# EasyEDA Pro project W5500-ESP32c3-supermini.epro

# Schematic Schematic1
Board Name: Board1; Create Date: 2026-04-03; Page Name: P1; Project Name: New Project_2026-04-03_12-46-23; Schematic Name: Schematic1; Update Date: 2026-04-04; Company: EasyEDA.com; Page Size: A4; Version: V1.0
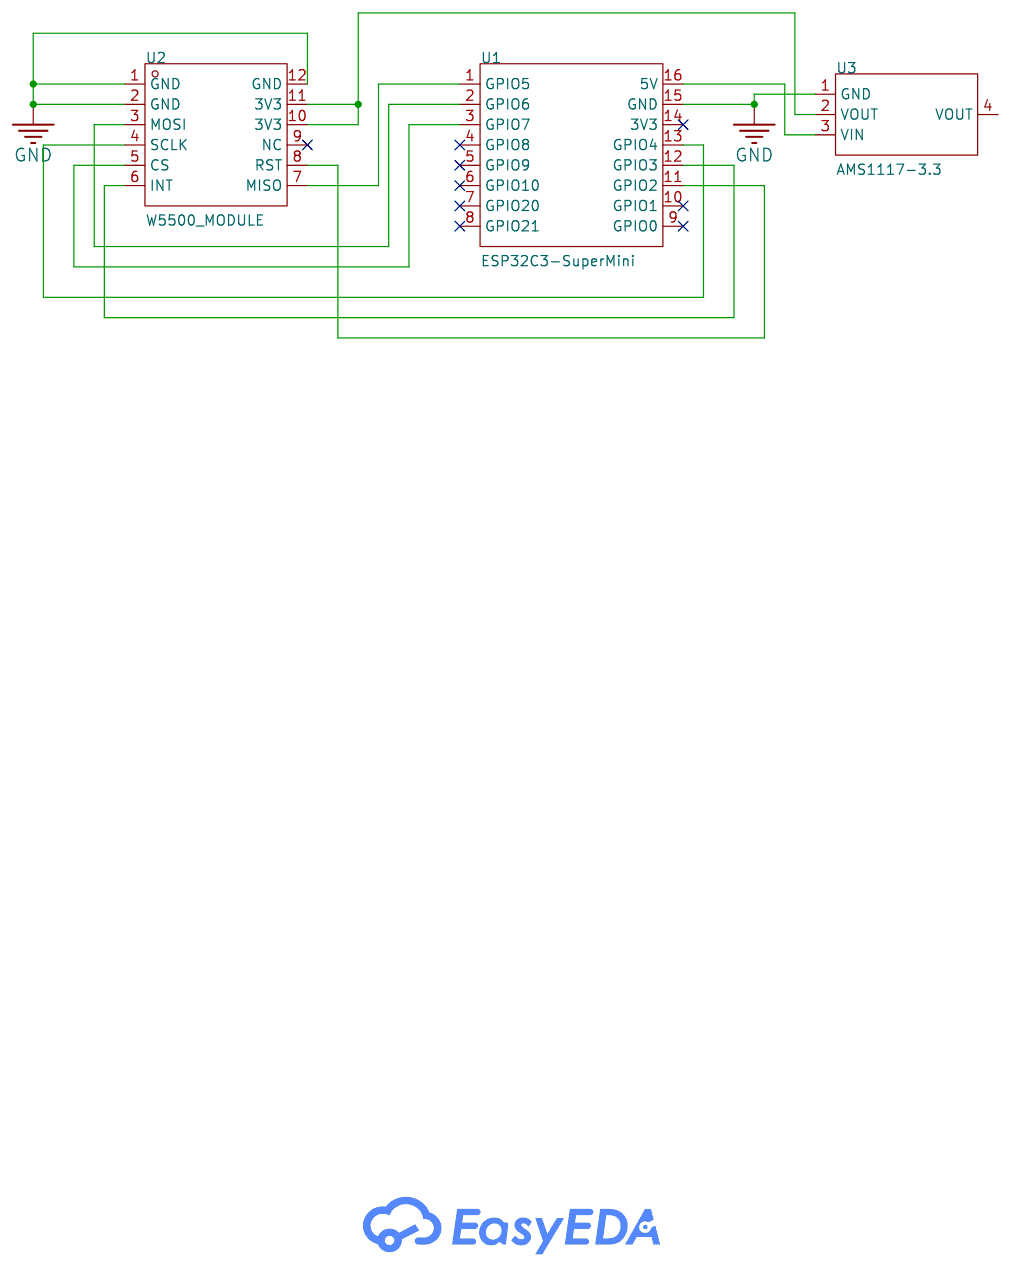
[diagram p0: schematic sheet]

## Parts
U1  ESP32C3-SuperMini  [COMM-SMD_16P-L22.5-W18.0-P2.54-TL]
U2  W5500_MODULE  [COMM-TH_L25.0-W23.0_W5500_MODULE]
U3  AMS1117-3.3  [SOT-223-3_L6.5-W3.4-P2.30-LS7.0-BR]

## Library data of the parts
U1 = ESP32C3-SuperMini: Supplier Part: C9900147397; Supplier Footprint: SMD-16P; JLCPCB Part Class: Extended Part; Supplier: LCSC
U2 = W5500_MODULE: Supplier Part: C9900160625; Supplier Footprint: 插件; Supplier: LCSC
U3 = AMS1117-3.3_C6186: Output Type:Fixed Voltage - Supply:15V Output Voltage:3.3V Output Voltage:3.3V Output Current:1A Power Supply Rejection Ratio (PSRR):72dB@(120Hz) Voltage Dropout:1.1V@(800mA) standby current:5mA Noise:0.003%Vout Features:Over Current Protection；Thermal Sh; LCSC Part Name: 3.3V 1A 15V; Supplier Part: C6186; Manufacturer: AMS; Supplier Footprint: SOT-223; JLCPCB Part Class: Basic Part; Datasheet: https://item.szlcsc.com/datasheet/AMS1117-3.3/6652.html; Supplier: LCSC; Output Type: Fixed; Voltage - Supply: 15V; Output Voltage: 3.3V; Output Current: 1A; Power Supply Rejection Ratio (PSRR): 72dB@(120Hz); Voltage Dropout: 1.1V@(800mA); standby current: 5mA; Noise: 0.003%Vout; Features: Over Current Protection；Thermal Shutdown; Operating Temperature: -40℃~+125℃; Output Configuration: Positive; Number of Outputs: 1

## Nets
GND: U1.15(GND) U2.1(GND) U2.2(GND) U2.12(GND) U3.1(GND)
$1N916: U1.16(5V) U3.3(VIN)
$1N945: U2.10(3V3) U2.11(3V3) U3.2(VOUT)
$1N963: U1.1(GPIO5) U2.7(MISO)
$1N981: U1.2(GPIO6) U2.3(MOSI)
$1N1018: U1.13(GPIO4) U2.4(SCLK)
$1N1030: U1.3(GPIO7) U2.5(CS)
$1N1039: U1.12(GPIO3) U2.6(INT)
$1N1051: U1.11(GPIO2) U2.8(RST)

Not connected (* = marked no-connect by the designer): U1 4(GPIO8)* 5(GPIO9)* 6(GPIO10)* 7(GPIO20)* 8(GPIO21)* 9(GPIO0)* 10(GPIO1)* 14(3V3)*; U2 9(NC)*; U3 4(VOUT)

# Board PCB4
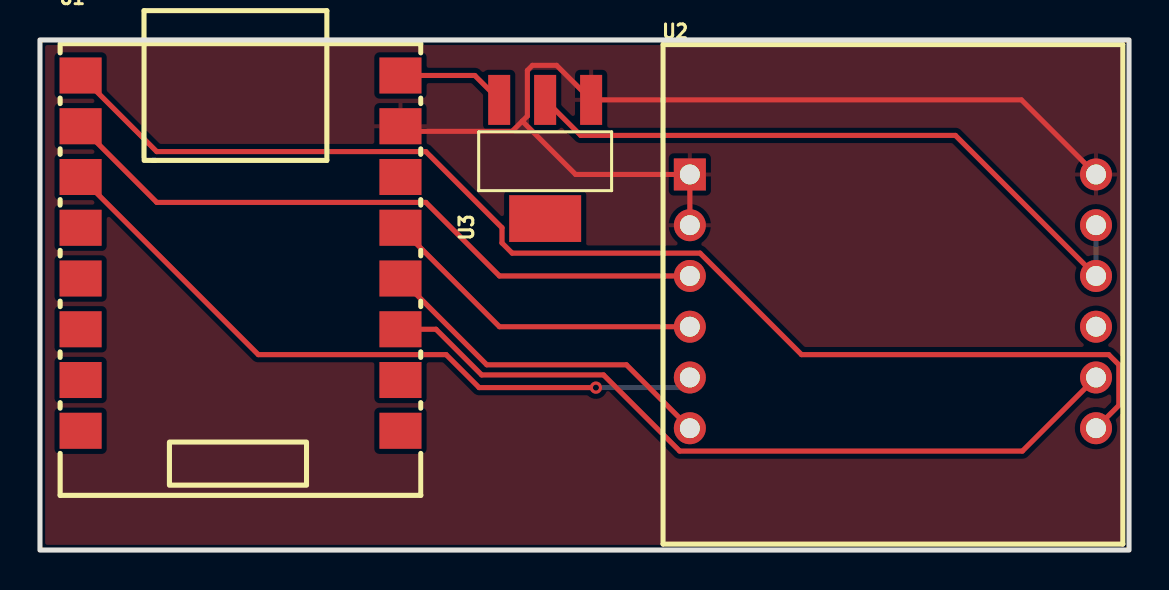
[diagram p1: board, top side]
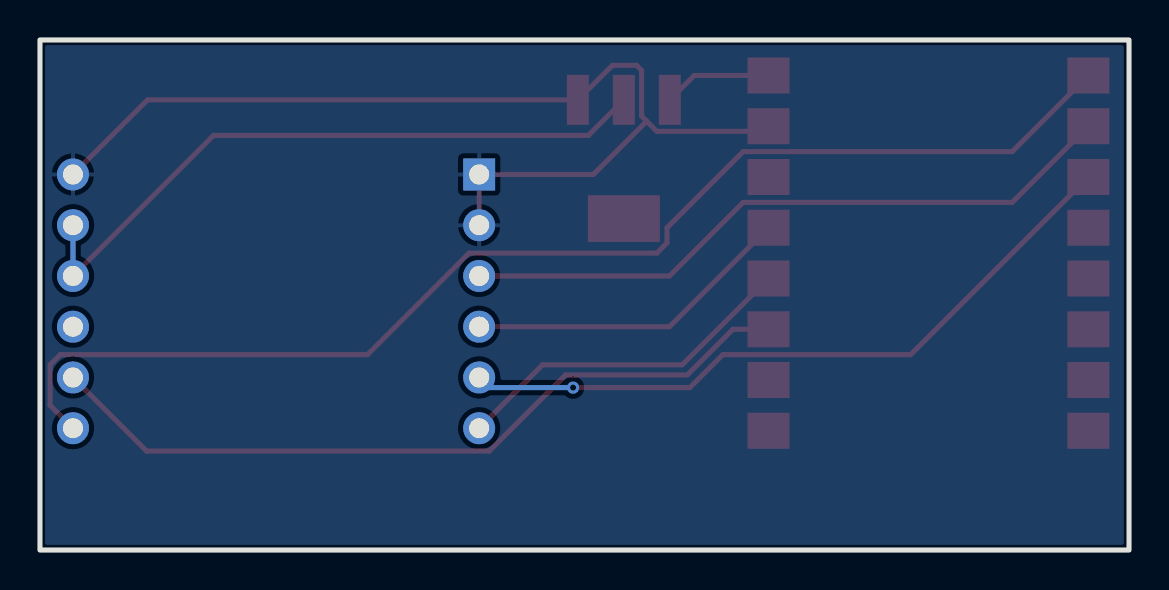
[diagram p2: board, bottom side, seen from below]

Outline 54.48 x 25.53 mm; copper layers: Top Layer, Bottom Layer. Coordinates in mm from the lower left corner of the outline.
Outline path: rectangle 0,25.53 54.48,0
Stack: Top Layer 0.035mm / Dielectric1 1.51mm FR4 er 4.5 / Bottom Layer 0.035mm

## Design rules (mm)
template: JLCPCB Capability(Two Layers Board)
spacing copperThickness1oz (default): track to track 0.102, other pairs 0.152 to 0.3
spacing copperThickness2oz: track to track 0.203, other pairs 0.152 to 0.3
track width copperThickness1oz (default): min 0.127, default 0.254, max 2.54
track width copperThickness2oz: min 0.203, default 0.254, max 2.54
differential pair differentialPair (default): width min 0.127, default 0.254, max 2.54; gap min 0.152, default 0.152
via viaSize (default): diameter min 0.5, default 0.61, max 10; hole min 0.3, default 0.305, max 6.3

## Placement (name value [footprint] x y rotation side)
U1  ESP32C3-SuperMini  [COMM-SMD_16P-L22.5-W18.0-P2.54-TL]  10.03 14.86 0 top
U2  W5500_MODULE  [COMM-TH_L25.0-W23.0_W5500_MODULE]  42.67 12.45 0 top
U3  AMS1117-3.3  [SOT-223-3_L6.5-W3.4-P2.30-LS7.0-BR]  25.27 19.56 90 top

## Footprints (pads in the part's own frame, mm; a bottom-side part is the same pattern mirrored in y, then rotated)
COMM-SMD_16P-L22.5-W18.0-P2.54-TL
  rect 2.102x1.802 smd: 1(-8.001,8.89) 2(-8.001,6.35) 3(-8.001,3.81) 4(-8.001,1.27) 5(-8.001,-1.27) 6(-8.001,-3.81) 7(-8.001,-6.35) 8(-8.001,-8.89) 9(8.001,-8.89) 10(8.001,-6.35) 11(8.001,-3.81) 12(8.001,-1.27) 13(8.001,1.27) 14(8.001,3.81) 15(8.001,6.35) 16(8.001,8.89)
COMM-TH_L25.0-W23.0_W5500_MODULE
  rect 1.6x1.6 hole 1: 1(-10.16,6.35)
  round 1.6 hole 1: 2(-10.16,3.81) 3(-10.16,1.27) 4(-10.16,-1.27) 5(-10.16,-3.81) 6(-10.16,-6.35) 7(10.16,-6.35) 8(10.16,-3.81) 9(10.16,-1.27) 10(10.16,1.27) 11(10.16,3.81) 12(10.16,6.35)
SOT-223-3_L6.5-W3.4-P2.30-LS7.0-BR
  rect 2.5x1.1 smd: 1(2.97,-2.3) 2(2.97,0) 3(2.97,2.3)
  rect 2.34x3.6 smd: 4(-2.97,0)

## Nets
As in the schematic.

Pads without a net: U1 4 5 6 7 8 9 10 14; U2 9; U3 4

## Via types
v1: diameter 0.61, hole 0.305, Top Layer to Bottom Layer, 1 via

## Routing (per net, layer and track width the routed paths; a pad name or vN(x,y) marks a point on that pad's centre or on a via; arc(x,y) is an arc through that point)
GND: length 51.9
  Top Layer w0.254: U2.12 49.1,22.53 U3.1 25.84,24.26 24.64,24.26 24.38,24 24.38,21.72 24.13,21.46 ; 18.03,21.21 18.29,20.95 23.62,20.95 24.13,21.46 ; 24.13,21.46 26.8,18.8 U2.1 U2.2
$1N916: length 5.4
  Top Layer w0.254: U3.3 21.75,23.75 U1.16
$1N945: length 33.7
  Top Layer w0.254: U3.2 27.05,20.75 45.8,20.75 U2.10
  Bottom Layer w0.254: U2.10 U2.11
$1N963: length 62
  Top Layer w0.254: U2.7 53.97,7.24 53.97,9.27 53.47,9.78 38.1,9.78 33.02,14.86 23.62,14.86 23.11,15.37 23.11,16.13 19.3,19.94 5.84,19.94 U1.1
$1N981: length 33.6
  Top Layer w0.254: 2.03,21.21 5.84,17.4 19.3,17.4 22.99,13.72 U2.3
$1N1018: length 16.5
  Top Layer w0.254: U2.4 22.99,11.18 U1.13
$1N1030: length 35.1
  Top Layer w0.254: v1(27.81,8.13) 21.97,8.13 20.32,9.78 10.92,9.78 U1.3
  Bottom Layer w0.254: v1(27.81,8.13) 32,8.13 U2.5
$1N1039: length 17.6
  Top Layer w0.254: U2.6 29.34,9.27 22.35,9.27 U1.12
$1N1051: length 38.8
  Top Layer w0.254: U2.8 49.15,4.95 32,4.95 28.19,8.76 22.1,8.76 19.81,11.05 U1.11

## Copper pours and planes (outline as drawn; the poured copper is in the pictures)
GND on Top Layer: 0,25.53 54.48,25.53 54.48,0 0,0
GND on Bottom Layer: 0,25.53 54.48,25.53 54.48,0 0,0
